# Altium schematic sheet smart home3.SchDoc
size A3
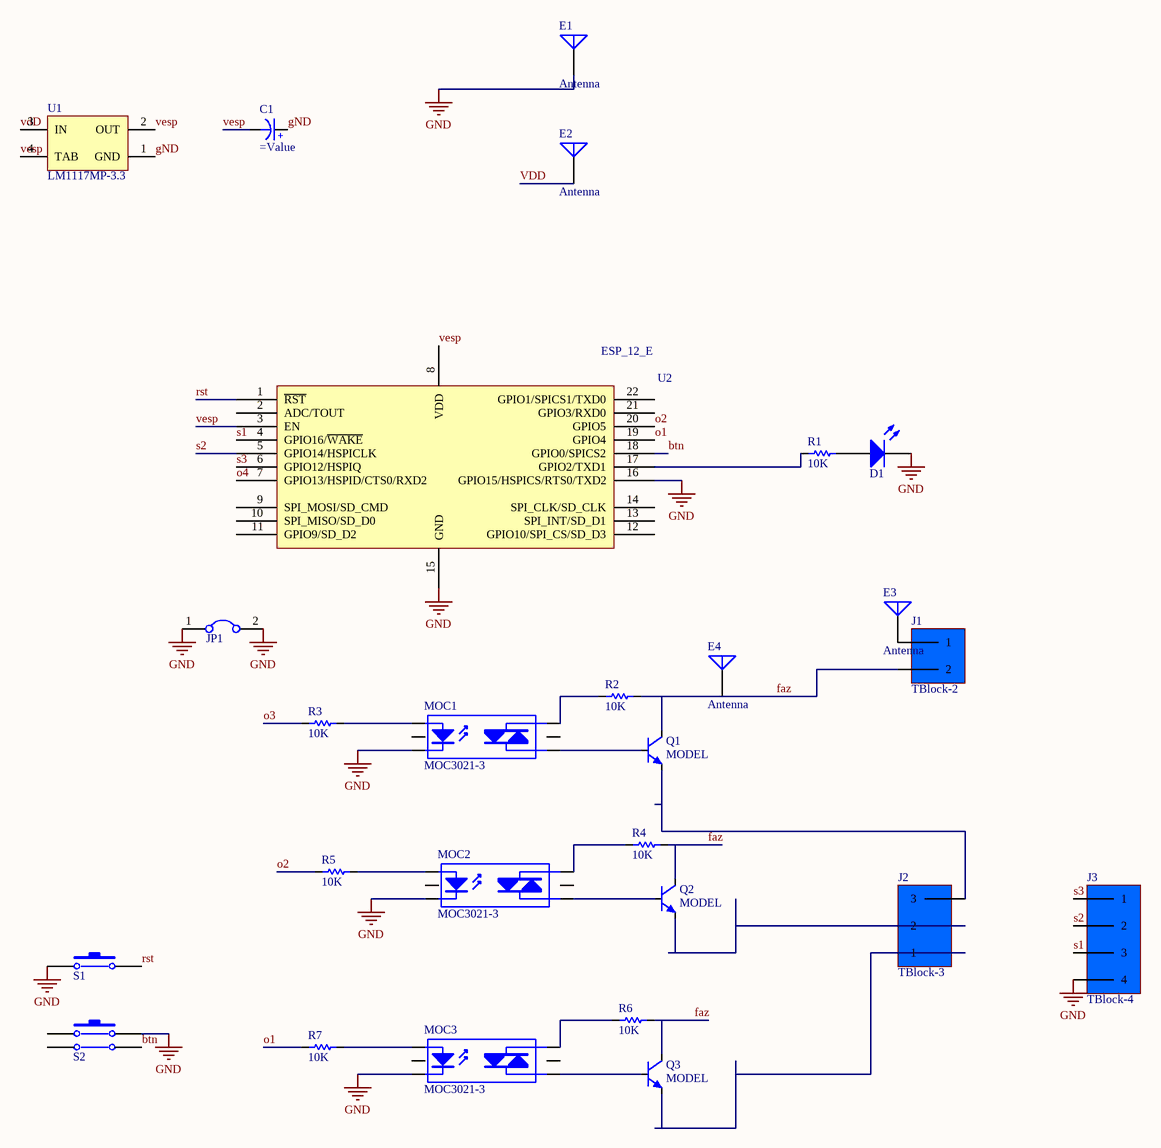
[diagram p0: smart home3.SchDoc]

## Parts
C1  (no value)  [ELEC-CAP-RAD10-20]
D1  LED 3mm  [LED-3mm]  (value not drawn)
E1  Antenna  [PIN1]
E2  Antenna  [PIN1]
E3  Antenna  [PIN1]
E4  Antenna  [PIN1]
J1  TBlock-2  [KF300-2 PIN]
J2  TBlock-3  [KF300-3 PIN]
J3  TBlock-4  [KF300-4 PIN]
JP1  Jumper  [Header 2X1]  (value not drawn)
MOC1  MOC3021-3  [DIP-6]
MOC2  MOC3021-3  [DIP-6]
MOC3  MOC3021-3  [DIP-6]
Q1  MODEL  [SOT32]
Q2  MODEL  [SOT32]
Q3  MODEL  [SOT32]
R1  10K  [RES 1206 (3216X08L)]
R2  10K  [RES 1206 (3216X08L)]
R3  10K  [RES 1206 (3216X08L)]
R4  10K  [RES 1206 (3216X08L)]
R5  10K  [RES 1206 (3216X08L)]
R6  10K  [RES 1206 (3216X08L)]
R7  10K  [RES 1206 (3216X08L)]
S1  PB-2pin  [PB-2pin]  (value not drawn)
S2  PUSH BUTTON DOUBLE  [PUSH BUTTON]  (value not drawn)
U1  LM1117MP-3.3  [MP04A_N]
U2  ESP_12_E  [ESP_12_E]

## Nets
gND: C1.2(+) D1.2(K) E1.1(A) J3.4 JP1.1 JP1.2 MOC1.2(K) MOC2.2(K) MOC3.2(K) S1.1 S2.2 U1.1(GND) U2.15(GND) U2.16(GPIO15/HSPICS/RTS0/TXD2)
btn: S2.4 U2.18(GPIO0/SPICS2)
faz: E4.1(A) J1.2 Q1.2(C) Q2.2(C) Q3.2(C) R2.2 R4.2 R6.2
o1: R7.1 U2.19(GPIO4)
o2: R5.1 U2.20(GPIO5)
o3: R3.1
o4: U2.7(GPIO13/HSPID/CTS0/RXD2)
rst: S1.2 U2.1(~{RST})
s1: J3.3 U2.4(GPIO16/~{WAKE})
s2: J3.2 U2.5(GPIO14/HSPICLK)
s3: J3.1 U2.6(GPIO12/HSPIQ)
vdD: E2.1(A) U1.3(IN)
vesp: C1.1(-) U1.2(OUT) U1.4(TAB) U2.3(EN) U2.8(VDD)
NetD1_1: D1.1(A) R1.2
NetE3_1: E3.1(A) J1.1
NetJ2_1: J2.1 Q3.1(E)
NetJ2_2: J2.2 Q2.1(E)
NetJ2_3: J2.3 Q1.1(E)
NetMOC1_1: MOC1.1(A) R3.2
NetMOC1_4: MOC1.4(A/K) R2.1
NetMOC1_6: MOC1.6(A/K) Q1.3(B)
NetMOC2_1: MOC2.1(A) R5.2
NetMOC2_4: MOC2.4(A/K) R4.1
NetMOC2_6: MOC2.6(A/K) Q2.3(B)
NetMOC3_1: MOC3.1(A) R7.2
NetMOC3_4: MOC3.4(A/K) R6.1
NetMOC3_6: MOC3.6(A/K) Q3.3(B)
NetR1_1: R1.1 U2.17(GPIO2/TXD1)

Not connected (* = marked no-connect by the designer): MOC1 3(NC) 5(NC); MOC2 3(NC) 5(NC); MOC3 3(NC) 5(NC); S2 1 3; U2 2(ADC/TOUT) 9(SPI_MOSI/SD_CMD) 10(SPI_MISO/SD_D0) 11(GPIO9/SD_D2) 12(GPIO10/SPI_CS/SD_D3) 13(SPI_INT/SD_D1) 14(SPI_CLK/SD_CLK) 21(GPIO3/RXD0) 22(GPIO1/SPICS1/TXD0)

## Library data of the parts
C1 = Capacitor Electrolytic: Electrolytic Capacitor
D1 = LED 3mm: Typical LED; Designer: Seyed Mohsen Ghasemian; Published: 02/04/2012; PackageReference: LED; Publisher: www.picpars.com; PackageDescription: LED; 2 Leads
E1-E4 = Antenna: Generic Antenna; Published: 24-Mar-1999; LatestRevisionDate: 17-Jul-2002; LatestRevisionNote: Re-released for DXP Platform.; PackageReference: PIN1; Publisher: Altium Limited
MOC1-MOC3 = MOC3021-3: Opto-Triac; Designer: Seyed Mohsen Ghasemian; E-mail: picpars@gmail.com; Published: 17-11-2011; LatestRevisionDate: 17-11-2011; Publisher: www.picpars.com; WEB: www.picpars.com
Q1-Q3 = BD139: NPN Bipolar Transistor
R1-R7 = Resistor: Tolerance: 5%; Power: 1/4 W; Value: 10K
S1 = PB-2pin: Switch; E-mail: picpars@gmail.com; Designer: Seyed Mohsen Ghasemian; Publisher: www.picpars.com; WEB: www.picpars.com
S2 = PUSH BUTTON DOUBLE: Switch
U1 = LM1117MP-3.3: 800mA Low-Dropout Linear Regulator; Manufacturer: National Semiconductor; CompType: LDO IC; PackageTopMarking: XYTT*N05A; PowerWise: N; Published: 4-Dec-2008; DatasheetVersion: Apr-2006; PackageVersion: revB, Apr-2003; PackageReference: MP04A; Publisher: Altium Limited; PackageDescription: Molded SOT-223, 6.50 x 3.56 x 1.6mm Body, 4 Lead, 2.3mm Pitch; PartNumber: LM1117MP-3.3; RoHS: O; PinCount: 4; DigiKeyPartNumber: LM1117MP-3.3CT-ND; Code_JEDEC: TO-261-AA; Code_IPC: SOT223-4; ComponentLink1Description: LM1117 Datasheet; ComponentLink1URL: http://www.national.com/ds/LM/LM1117.pdf; ComponentLink2Description: LM1117 Web Page; ComponentLink2URL: http://www.national.com/pf/LM/LM1117.html; ComponentLink3Description: MP04A Package Page; ComponentLink3URL: http://www.national.com/packaging/folders/mp04a.html
U2 = ESP_12_E: ESP-12 Wi-Fi Module by AI-Thinker; IC: ESP8266-EX; Vendor: Ai-thinker